# EAGLE schematic blink1mk3_micro1d2 (EAGLE 9.1.0)
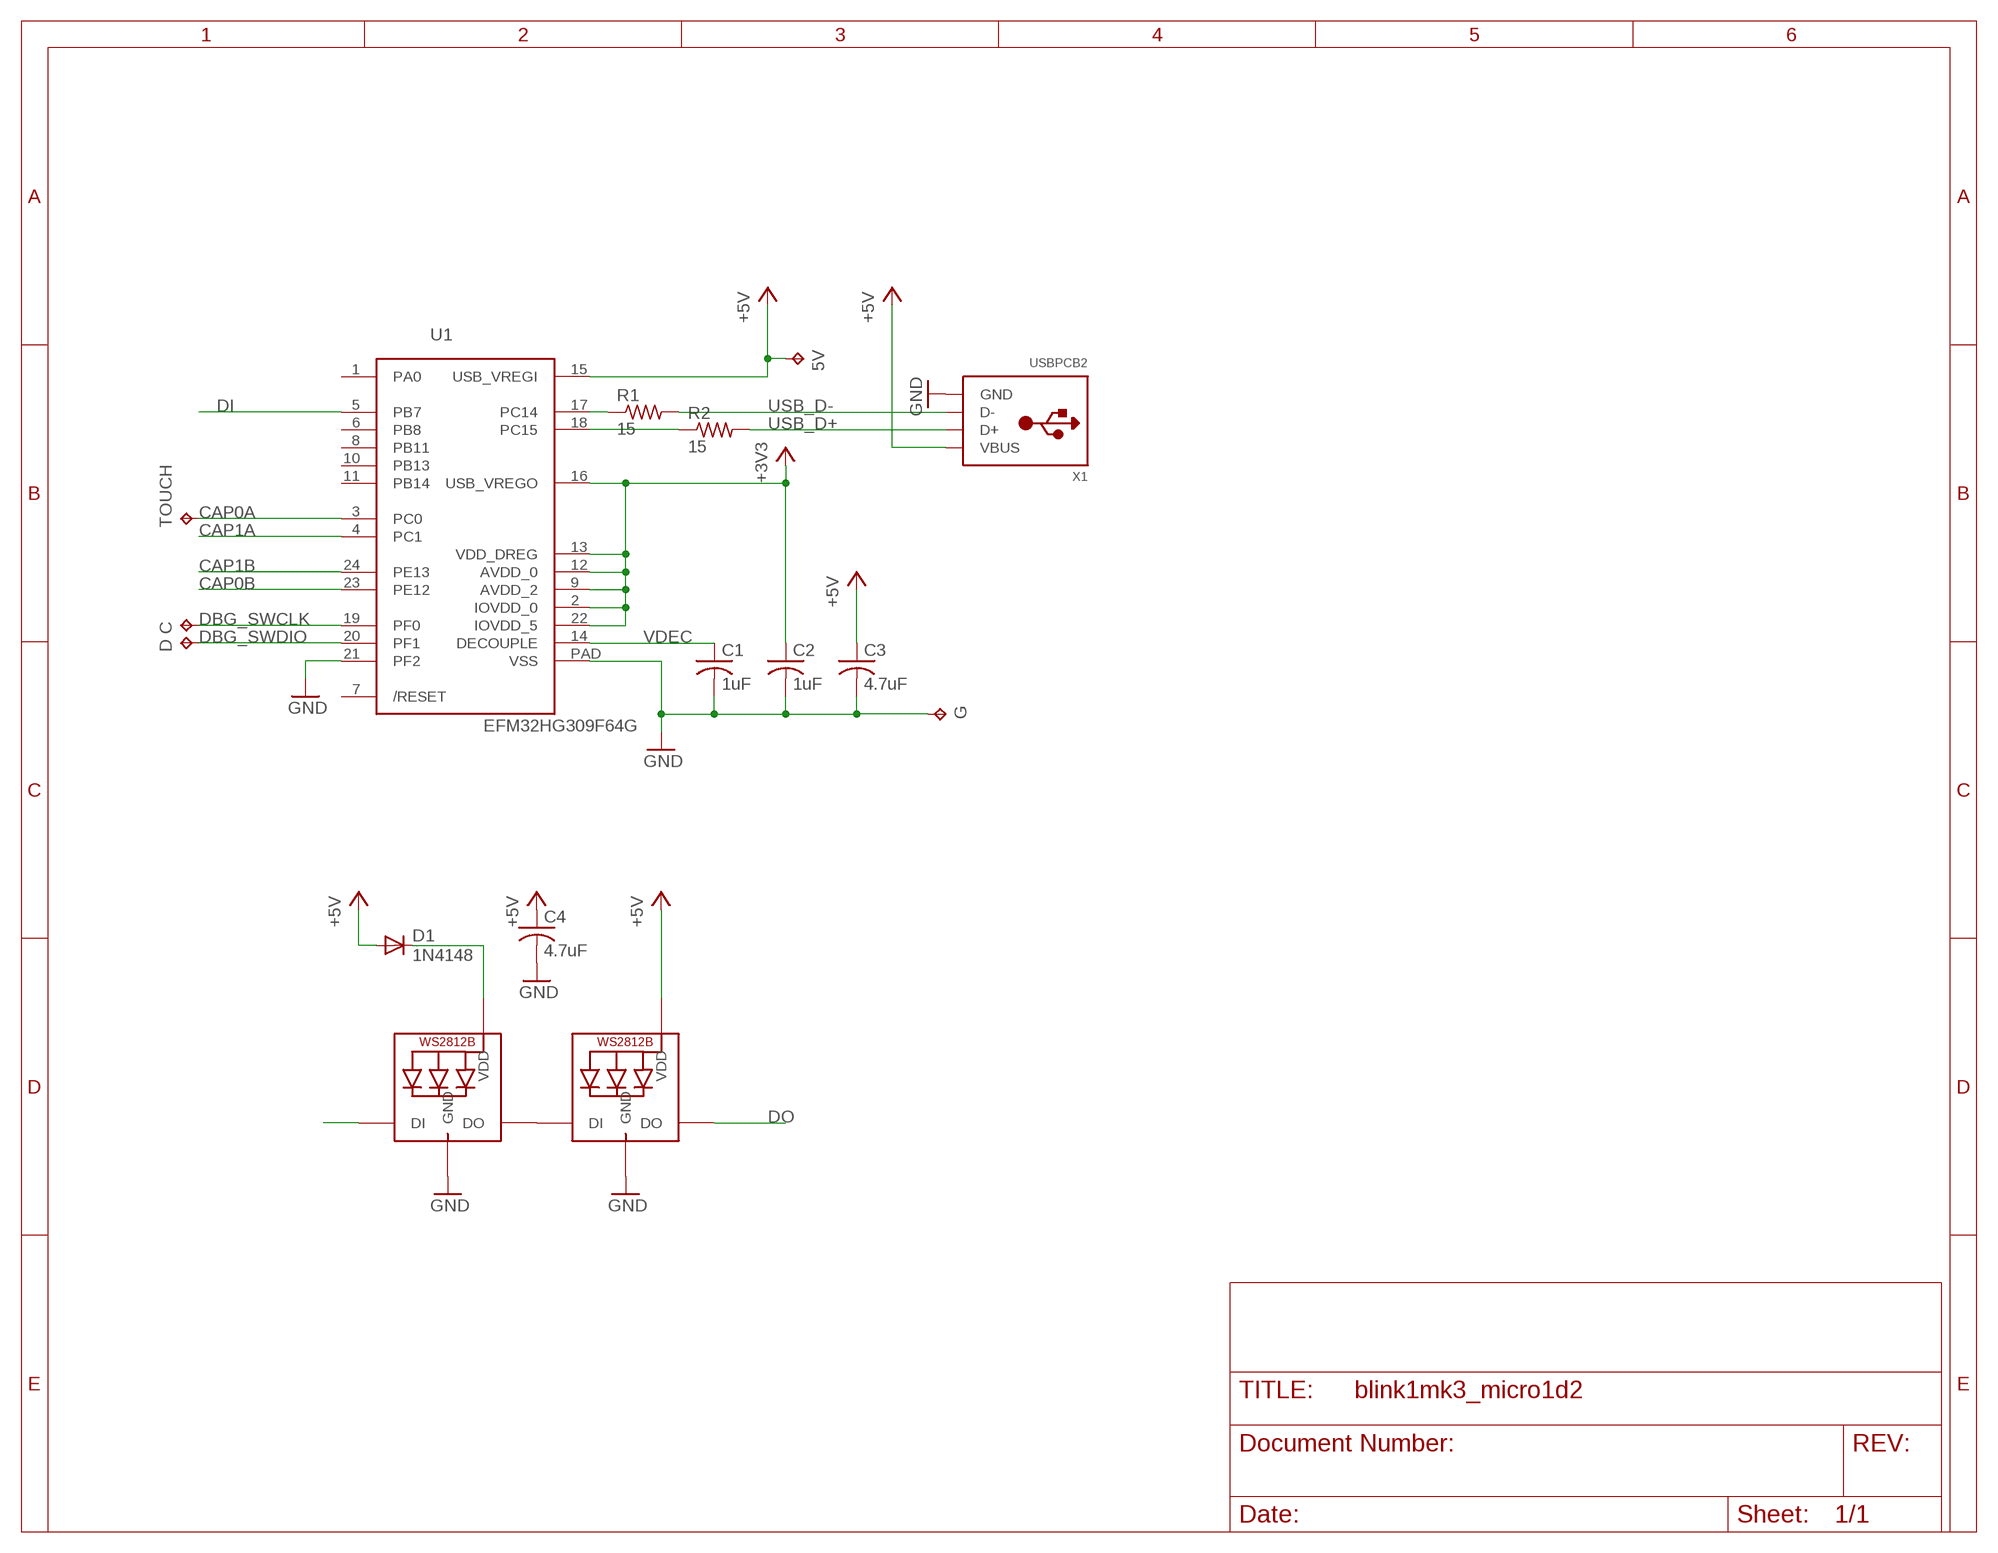
[diagram p0: schematic, sheet 1]

## Parts
5V  TPTP10R  [TP10R]
C  TPTP10R  [TP10R]
C1  1uF  C-USC0402  [C0402]
C2  1uF  C-USC0402  [C0402]
C3  4.7uF  C-USC0402  [C0402]
C4  4.7uF  C-USC0402  [C0402]
D  TPTP10R  [TP10R]
D1  1N4148  DIODE-SOD523  [SOD523]
G  TPTP10SQ  [TP10SQ]
LED1  WS2812B4020SIDE  [SK6812-SIDE]
LED2  WS2812B4020SIDE  [SK6812-SIDE]
R1  15  R-US_R0402  [R0402]
R2  15  R-US_R0402  [R0402]
TOUCH  TPTP10R  [TP10R]
U1  EFM32HG309F64G  [QFN24PAD]
X1  USBPCB2  [USB-A-PCB-2]

## Nets
+3V3: C2.1 U1.2(IOVDD_0) U1.9(AVDD_2) U1.12(AVDD_0) U1.13(VDD_DREG) U1.16(USB_VREGO) U1.22(IOVDD_5)
+5V: 5V.TP C3.1 C4.1 D1.A LED2.1-VDD(VDD) U1.15(USB_VREGI) X1.5V(VBUS)
CAP0A: TOUCH.TP U1.3(PC0)
CAP0B: U1.23(PE12)
CAP1A: U1.4(PC1)
CAP1B: U1.24(PE13)
DBG_SWCLK: C.TP U1.19(PF0)
DBG_SWDIO: D.TP U1.20(PF1)
DI: LED1.4-DIN(DI) U1.5(PB7)
DO: LED2.2-DOUT(DO)
GND: C1.2 C2.2 C3.2 C4.2 G.TP LED1.3-GND(GND) LED2.3-GND(GND) U1.21(PF2) U1.PAD(VSS) X1.GND
N$1: LED1.2-DOUT(DO) LED2.4-DIN(DI)
N$2: R1.1 U1.17(PC14)
N$3: R2.1 U1.18(PC15)
N$5: D1.C LED1.1-VDD(VDD)
USB_D+: R2.2 X1.USB_P(D+)
USB_D-: R1.2 X1.USB_M(D-)
VDEC: C1.1 U1.14(DECOUPLE)
Unconnected: U1.1(PA0) U1.6(PB8) U1.7(/RESET) U1.8(PB11) U1.10(PB13) U1.11(PB14)

## Library data of the parts
5V C D G TOUCH = testpad:TP: Test pad
C1-C4 = rcl:C-US: CAPACITOR, American symbol; SPICEPREFIX: C
D1 = diode:DIODE-: DIODE
LED1 LED2 = todstuff:WS2812B
R1 R2 = adafruit:R-US_: RESISTOR, American symbol
U1 = todstuff:EFM32HG309F64G
X1 = todstuff:USB